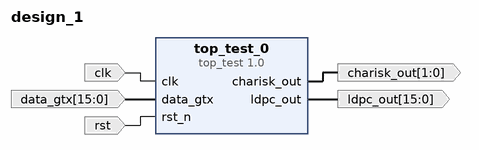
[diagram p0: block diagram of the top level]
# Vivado block design design_1, xc7k325tffg900-2, Vivado 2017.4
create_bd_design design_1

create_bd_port -dir I -type clk clk
create_bd_port -dir I -from 15 -to 0 data_gtx
create_bd_port -dir O -from 15 -to 0 ldpc_out
create_bd_port -dir O -from 1 -to 0 charisk_out
create_bd_port -dir I -type rst rst

create_bd_cell -type ip -vlnv gpnewtech.com:userdefine:top_test:1.0 top_test_0

# ---- connections ----

connect_bd_net -net clk_0_1 [get_bd_ports clk] [get_bd_pins top_test_0/clk]
connect_bd_net -net data_gtx_0_1 [get_bd_ports data_gtx] [get_bd_pins top_test_0/data_gtx]
connect_bd_net [get_bd_pins top_test_0/ldpc_out] [get_bd_ports ldpc_out]
connect_bd_net [get_bd_pins top_test_0/charisk_out] [get_bd_ports charisk_out]
connect_bd_net -net rst_n_0_1 [get_bd_ports rst] [get_bd_pins top_test_0/rst_n]

validate_bd_design
save_bd_design
